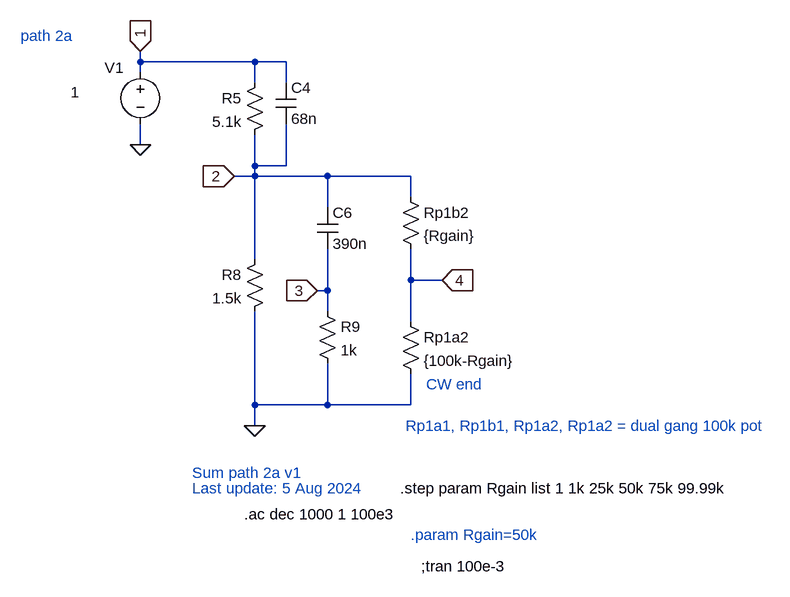
[diagram p0: schematic Klon-Centaur_sum_path2a_v1.asc]
Klon-Centaur_sum_path2a_v1.asc, the LTspice schematic file:
Version 4
SHEET 1 4496 5064
WIRE -384 2640 -384 2624
WIRE -208 2640 -384 2640
WIRE -160 2640 -208 2640
WIRE -384 2656 -384 2640
WIRE -208 2672 -208 2640
WIRE -160 2672 -160 2640
WIRE -384 2768 -384 2736
WIRE -208 2800 -208 2752
WIRE -160 2800 -160 2736
WIRE -160 2800 -208 2800
WIRE -208 2816 -208 2800
WIRE -208 2816 -240 2816
WIRE -96 2816 -208 2816
WIRE 32 2816 -96 2816
WIRE 32 2848 32 2816
WIRE -96 2864 -96 2816
WIRE -208 2944 -208 2816
WIRE 32 2976 32 2928
WIRE 80 2976 32 2976
WIRE -96 2992 -96 2928
WIRE -96 2992 -112 2992
WIRE -96 3024 -96 2992
WIRE 32 3040 32 2976
WIRE -208 3168 -208 3024
WIRE -96 3168 -96 3104
WIRE -96 3168 -208 3168
WIRE 32 3168 32 3120
WIRE 32 3168 -96 3168
WIRE -208 3200 -208 3168
FLAG -208 3200 0
FLAG -112 2992 3
IOPIN -112 2992 In
FLAG -240 2816 2
IOPIN -240 2816 In
FLAG -384 2624 1
IOPIN -384 2624 In
FLAG -384 2768 0
FLAG 80 2976 4
IOPIN 80 2976 In
SYMBOL res -192 2656 M0
SYMATTR InstName R5
SYMATTR Value 5.1k
SYMBOL res -192 2928 M0
SYMATTR InstName R8
SYMATTR Value 1.5k
SYMBOL cap -176 2672 R0
SYMATTR InstName C4
SYMATTR Value 68n
SYMBOL cap -112 2864 R0
SYMATTR InstName C6
SYMATTR Value 390n
SYMBOL res -112 3008 R0
SYMATTR InstName R9
SYMATTR Value 1k
SYMBOL res 16 2832 R0
SYMATTR InstName Rp1b2
SYMATTR Value {Rgain}
SYMBOL res 16 3024 R0
SYMATTR InstName Rp1a2
SYMATTR Value {100k-Rgain}
SYMBOL voltage -384 2640 R0
WINDOW 0 -55 9 Left 2
WINDOW 39 0 0 Left 0
WINDOW 3 -107 47 Left 2
SYMATTR InstName V1
SYMATTR Value 1
TEXT -224 3336 Left 2 !.ac dec 1000 1 100e3
TEXT 56 3136 Left 2 ;CW end
TEXT 16 3296 Left 2 !.step param Rgain list 1 1k 25k 50k 75k 99.99k
TEXT 24 3200 Left 2 ;Rp1a1, Rp1b1, Rp1a2, Rp1a2 = dual gang 100k pot
TEXT 48 3416 Left 2 !;tran 100e-3
TEXT 32 3368 Left 2 ;.param Rgain=50k
TEXT -304 3272 Left 2 ;Sum path 2a v1
TEXT -568 2600 Left 2 ;path 2a
TEXT -304 3296 Left 2 ;Last update: 5 Aug 2024

The netlist it stands for:
* Klon-Centaur_sum_path2a_v1.asc
R5 1 2 5.1k
R8 2 0 1.5k
C4 1 2 68n
C6 2 3 390n
R9 3 0 1k
Rp1b2 2 4 {Rgain}
Rp1a2 4 0 {100k-Rgain}
V1 1 0 1
.ac dec 1000 1 100e3
* CW end
.step param Rgain list 1 1k 25k 50k 75k 99.99k
* Rp1a1, Rp1b1, Rp1a2, Rp1a2 = dual gang 100k pot
;tran 100e-3
* .param Rgain=50k
* Sum path 2a v1
* path 2a
* Last update: 5 Aug 2024
.backanno
.end